# EAGLE design STl-Link-V200 (EAGLE 7.3.0)
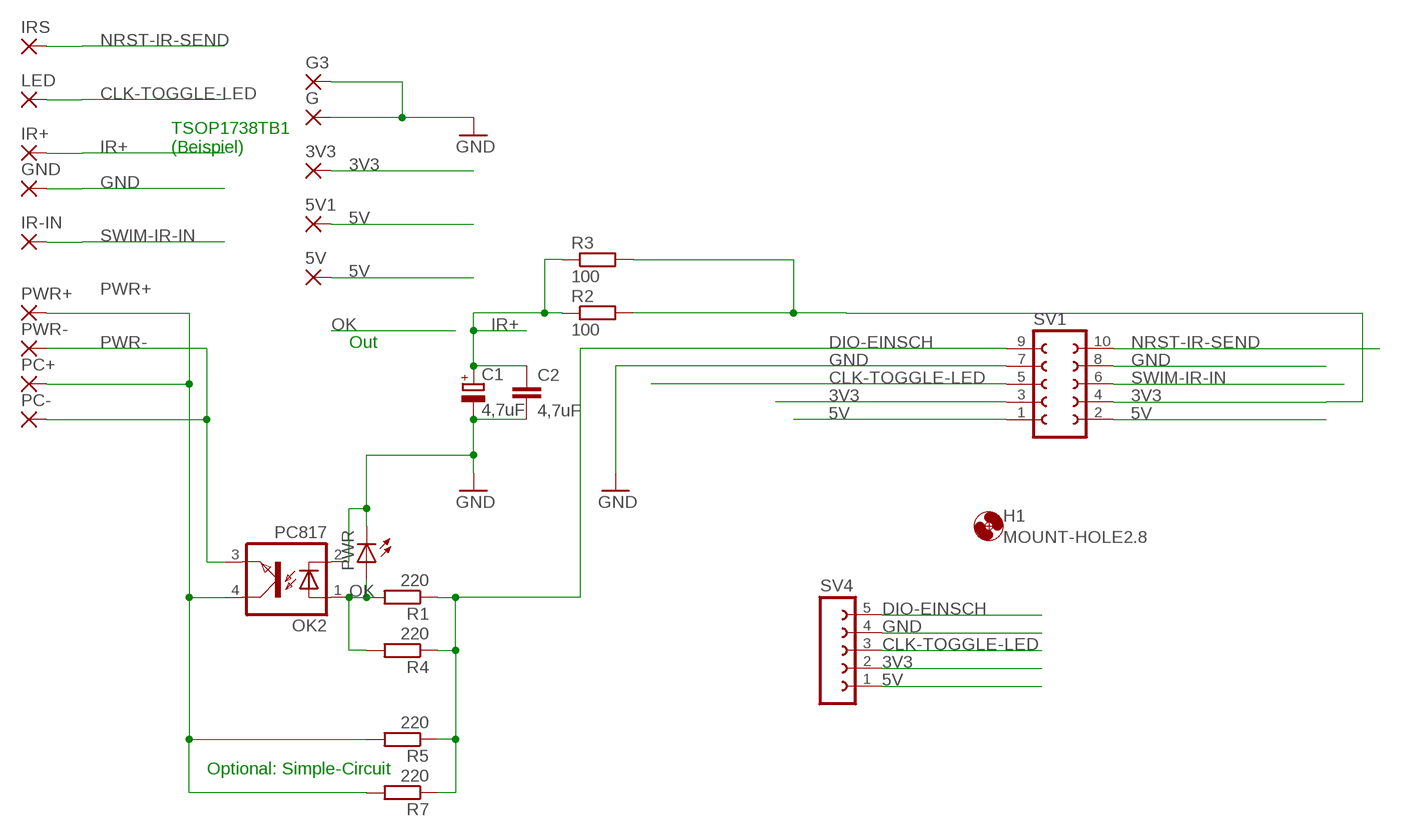
[diagram p0: schematic, sheet 1]

## Parts
3V3  SMD2  [SMD1,27-2,54]
5V  SMD2  [SMD1,27-2,54]
5V1  SMD2  [SMD1,27-2,54]
C1  4,7uF  CPOL-EUE1.8-4  [E1,8-4]
C2  4,7uF  C-EUC1206K  [C1206K]
G  SMD2  [SMD1,27-2,54]
G3  SMD2  [SMD1,27-2,54]
GND  SMD2  [SMD1,27-2,54]
H1  MOUNT-HOLE2.8  [2,8]
IR+  SMD2  [SMD1,27-2,54]
IR-IN  SMD2  [SMD1,27-2,54]
IRS  SMD2  [SMD1,27-2,54]
LED  SMD2  [SMD1,27-2,54]
OK2  PC817  [DIL04]
PC+  SMD2  [SMD1,27-2,54]
PC-  SMD2  [SMD1,27-2,54]
PWR  LEDCHIPLED_1206  [CHIPLED_1206]
PWR+  SMD2  [SMD1,27-2,54]
PWR-  SMD2  [SMD1,27-2,54]
R1  220  R-EU_0204/7  [0204/7]
R2  100  R-EU_0204/7  [0204/7]
R3  100  R-EU_R0805W  [R0805W]
R4  220  R-EU_R0805W  [R0805W]
R5  220  R-EU_0204/7  [0204/7]
R7  220  R-EU_R0805W  [R0805W]
SV1  FE05-2  [FE05-2]
SV4  FE05-1  [FE05-1]

## Nets
3V3: 3V3.1(P) R2.2 R3.2 SV1.3 SV1.4 SV4.2
5V: 5V1.1(P) 5V.1(P) SV1.1 SV1.2 SV4.1
CLK-TOGGLE-LED: LED.1(P) SV1.5 SV4.3
DIO-EINSCH: R1.1 R4.1 R5.1 R7.1 SV1.9 SV4.5
GND: C1.- C2.2 G3.1(P) G.1(P) GND.1(P) OK2.2(C) PWR.C SV1.7 SV1.8 SV4.4
IR+: C1.+ C2.1 IR+.1(P) R2.1 R3.1
NRST-IR-SEND: IRS.1(P) SV1.10
OK: OK2.1(A) PWR.A R1.2 R4.2
PWR+: OK2.4(COL) PC+.1(P) PWR+.1(P) R5.2 R7.2
PWR-: OK2.3(EMIT) PC-.1(P) PWR-.1(P)
SWIM-IR-IN: IR-IN.1(P) SV1.6

## Notes on the sheet
- TSOP1738TB1
  (Beispiel)
- Out
- Optional: Simple-Circuit

## Library data of the parts
3V3 5V 5V1 G G3 GND IR+ IR-IN IRS LED PC+ PC- PWR+ PWR- = wirepad:SMD2: SMD PAD
C1 = rcl:CPOL-EU: POLARIZED CAPACITOR, European symbol
C2 = rcl:C-EU: CAPACITOR, European symbol
H1 = holes:MOUNT-HOLE: MOUNTING HOLE with drill center marker
OK2 = optocoupler:PC817: SHARP OPTO COUPLER; MPN: PC817X4J000F; OC_FARNELL: 9707727; OC_NEWARK: 97K7059
PWR = led:LED: LED OSRAM: - CHIPLED LG R971, LG N971, LY N971, LG Q971, LY Q971, LO R971, LY R971 LH N974, LH R974 LS Q976, LO Q976, LY Q976 LO Q996 - Hyper CHIPLED LW Q18S LB Q993, LB Q99A, LB R99A - SideLED LS A670, LO A670, LY A670, LG A670, LP A670 LB A673, LV A673, LT A673, LW A673 LH A674 LY A675 LS A676, LA A676, LO A676, LY A676, LW A676 LS A679, LY A679, LG A679 - Hyper Micro SIDELED® LS Y876, LA Y876, LO Y876, LY Y876 LT Y87S - SmartLED LW L88C, LW L88S LB L89C, LB L89S, LG L890 LS L89K, LO L89K, LY L89K LS L896, LA L896, LO L896, LY L896 - TOPLED LS T670, LO T670, LY T670, LG T670, LP T670 LSG T670, LSP T670, LSY T670, LOP T670, LYG T670 LG T671, LOG T671, LSG T671 LB T673, LV T673, LT T673, LW T673 LH T674 LS T676, LA T676, LO T676, LY T676, LB T676, LH T676, LSB T676, LW T676 LB T67C, LV T67C, LT T67C, LS T67K, LO T67K, LY T67K, LW E67C LS E67B, LA E67B, LO E67B, LY E67B, LB E67C, LV E67C, LT E67C LW T67C LS T679, LY T679, LG T679 LS T770, LO T770, LY T770, LG T770, LP T770 LB T773, LV T773, LT T773, LW T773 LH T774 LS E675, LA E675, LY E675, LS T675 LS T776, LA T776, LO T776, LY T776, LB T776 LHGB T686 LT T68C, LB T68C - Hyper Mini TOPLED® LB M676 - Mini TOPLED Santana® LG M470 LS M47K, LO M47K, LY M47K Source: http://www.osram.convergy.de LUXEON: - LUMILED® LXK2-PW12-R00, LXK2-PW12-S00, LXK2-PW14-U00, LXK2-PW14-V00 LXK2-PM12-R00, LXK2-PM12-S00, LXK2-PM14-U00 LXK2-PE12-Q00, LXK2-PE12-R00, LXK2-PE12-S00, LXK2-PE14-T00, LXK2-PE14-U00 LXK2-PB12-K00, LXK2-PB12-L00, LXK2-PB12-M00, LXK2-PB14-N00, LXK2-PB14-P00, LXK2-PB14-Q00 LXK2-PR12-L00, LXK2-PR12-M00, LXK2-PR14-Q00, LXK2-PR14-R00 LXK2-PD12-Q00, LXK2-PD12-R00, LXK2-PD12-S00 LXK2-PH12-R00, LXK2-PH12-S00 LXK2-PL12-P00, LXK2-PL12-Q00, LXK2-PL12-R00 Source: www.luxeon.com KINGBRIGHT: KA-3528ASYC Source: www.kingbright.com
R1-R5 R7 = rcl:R-EU_: RESISTOR, European symbol
SV1 = con-lsta:FE05-2: FEMALE HEADER; OC_FARNELL: unknown; OC_NEWARK: unknown
SV4 = con-lsta:FE05-1: FEMALE HEADER; OC_FARNELL: unknown; OC_NEWARK: unknown

## Net classes
0 default: width 0.406 mm

## Board
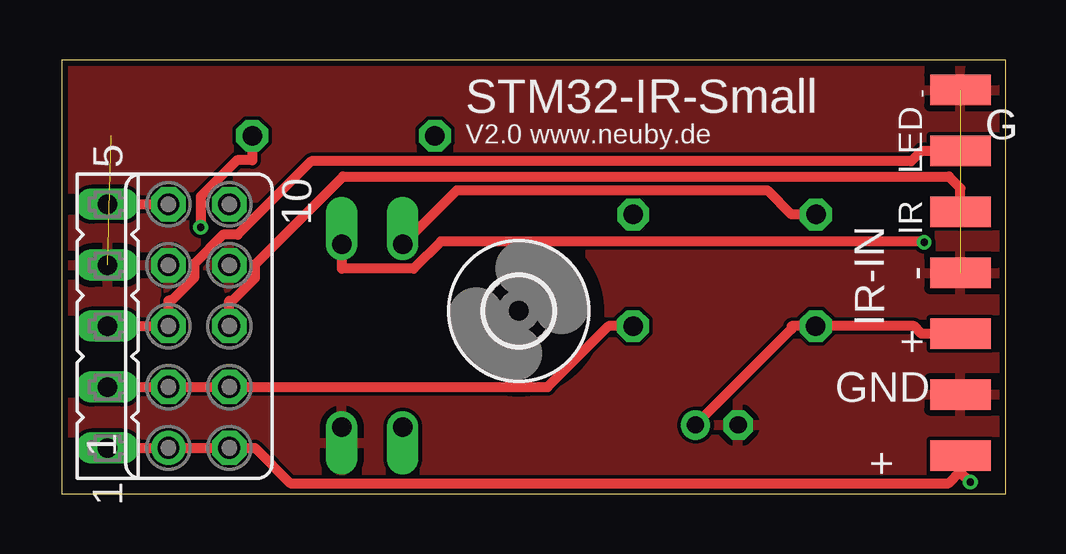
[diagram p1: board, top side]
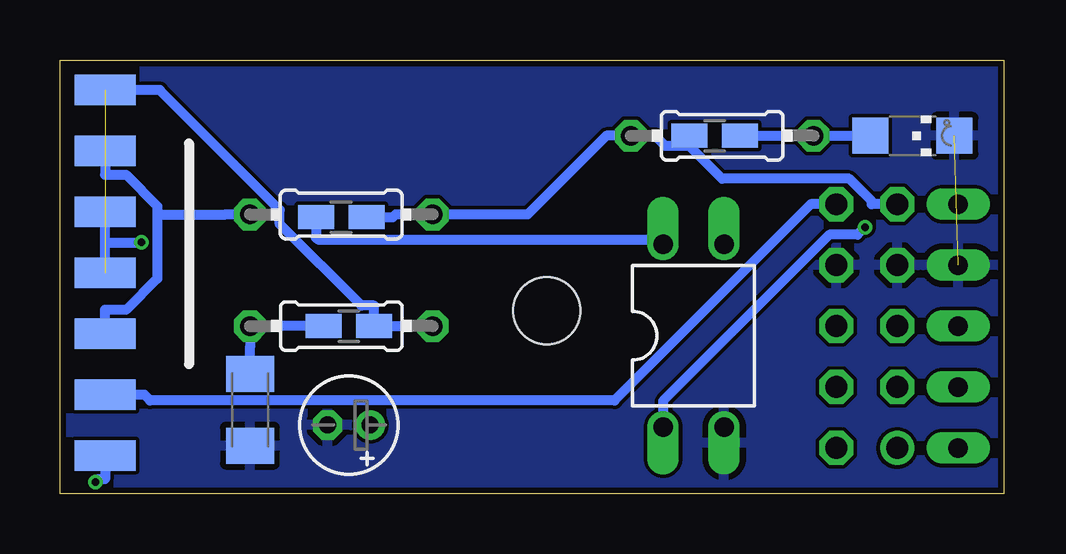
[diagram p2: board, bottom side, seen from below]

Size 39.35 x 18.09 mm. Coordinates in mm from the lower left corner, seen from the top.
Outline: 0,0 39.35,0 39.35,18.09 0,18.09 0,0
Copper layers (1*16): Top 0.035mm / dielectric 1.5mm / Bottom 0.035mm
Design rules "Fusion_eagle_rule_v1.1": minimum track width 6mil, minimum drill 12mil, track to track 6mil, track to pad 6mil, pad to pad 6mil, via to via 6mil, smd to smd 0mil, copper to edge 10mil, drill to drill 10mil, minimum pad ring 10mil, minimum via ring 6mil, stop-mask expansion 2mil, vias tented up to drill 100mil, thermal gap 10mil

### Footprints (pad centres in the part's own frame; a part is rotated, then mirrored left to right if it is on the bottom)
SMD1,27-2,54 = smd 1.27 x 2.54: 1 0,0
E1,8-4 = drill 0.711 pad 1.168: + -0.889,0 | drill 0.711 pad 1.168 octagon: - 0.889,0
C1206K = smd 1.5 x 2: 1 -1.5,0; 2 1.5,0
2,8 = hole 2.8: 0,0
DIL04 = drill 0.813 offset: 1 -1.27,-3.81; 2 1.27,-3.81; 3 1.27,3.81; 4 -1.27,3.81
CHIPLED_1206 = smd 1.5 x 1.5: A 0,-1.75; C 0,1.75
0204/7 = drill 0.813 octagon: 1 -3.81,0; 2 3.81,0
R0805W = smd 1.5 x 1: 1 -1.052,0; 2 1.052,0
FE05-2 = drill 0.914: 1 -5.08,1.27 | drill 0.914 octagon: 2 -5.08,-1.27; 3 -2.54,1.27; 4 -2.54,-1.27; 5 0,1.27; 6 0,-1.27; 7 2.54,1.27; 8 2.54,-1.27; 9 5.08,1.27; 10 5.08,-1.27
FE05-1 = drill 0.813 long: 1 -5.08,0; 2 -2.54,0; 3 0,0; 4 2.54,0; 5 5.08,0

### Placement (x,y rotation side)
3V3  37.47,16.83 90 bottom
5V  37.47,1.59 270 top
5V1  37.47,1.59 90 bottom
C1  27.3,2.86 180 bottom
C2  31.43,3.49 270 bottom
G  37.47,16.83 90 top
G3  37.47,4.13 90 top
GND  37.47,9.21 90 top
H1  19.05,7.62 0 top
IR+  37.47,6.67 90 top
IR-IN  37.47,11.75 90 top
IRS  37.47,4.13 270 bottom
LED  37.47,14.29 270 top
OK2  12.94,6.58 0 bottom
PC+  37.47,14.29 90 bottom
PC-  37.47,11.75 90 bottom
PWR  3.81,14.92 270 bottom
PWR+  37.47,6.67 90 bottom
PWR-  37.47,9.21 90 bottom
R1  11.75,14.92 0 bottom
R2  27.62,6.99 0 bottom
R3  27.3,6.99 0 bottom
R4  12.06,14.92 0 bottom
R5  27.63,11.64 180 bottom
R7  27.63,11.53 180 bottom
SV1  5.71,6.99 90 top
SV4  1.91,6.99 90 top

### Tracks (layer width: path | path; a pad name or v marks a point on that pad's centre or on a via)
3V3
  Top 0.406: R2.2 22.8,6.99 20.26,4.45 SV1.4 SV1.3 SV4.2
  Bottom 0.406: 3V3.1 35.18,16.83 30.18,11.83 30.18,11.24 26.79,7.84 26.25,7.84 R3.2 R2.2
5V  (via drill 0.3 pad 0.61)
  Top 0.406: 37.47,0.93 37.47,0.89 v37.87,0.48 | 5V1.1 37.47,0.93 | 37.47,0.93 36.97,0.44 9.52,0.44 8.05,1.91 SV1.2 SV1.1 SV4.1
  Bottom 0.406: 5V1.1 37.47,0.6 37.76,0.6 v37.87,0.48
CLK-TOGGLE-LED
  Top 0.406: SV4.3 SV1.5 4.45,8.05 4.58,8.05 5.51,8.98 5.51,9.58 6.72,10.79 7.33,10.79 10.4,13.86 35.41,13.86 35.84,14.29 LED.1
DIO-EINSCH
  Top 0.406: SV4.5 SV1.9
  Bottom 0.406: R7.1 25.47,11.53 25.36,11.64 R5.1 19.86,11.64 16.57,14.92 R1.1 14.54,14.92 14.11,14.49 13.12,14.49 | SV1.9 5.51,12.06 5.51,12.2 6.45,13.13 11.75,13.13 13.12,14.49 | R4.1 13.12,14.49
GND  (2 unrouted)
  pour Top: 0,18.1 0,0 39.37,0 39.37,17.78
  pour Bottom: 0,0 39.37,0 39.37,17.78 0,18.1
IR+
  Top 0.406: C1.+ 30.42,6.86 30.42,6.99 R2.1 35.52,6.99 35.84,6.67 IR+.1
  Bottom 0.406: R3.1 R2.1 31.43,6.1 C2.1
NRST-IR-SEND
  Bottom 0.406: IRS.1 35.84,4.13 35.6,3.89 16.23,3.89 8.05,12.06 SV1.10
OK  (via drill 0.3 pad 0.61)
  Top 0.406: R1.2 7.94,13.91 7.3,13.91 5.79,12.39 v5.79,11.11
  Bottom 0.406: v5.79,11.11 6.1,10.79 7.28,10.79 14.21,3.86 OK2.1 | PWR.A R1.2 R4.2
PWR+
  Top 0.406: R5.2 30.42,11.64 29.41,12.65 16.47,12.65 OK2.4
  Bottom 0.406: R7.2 28.68,10.67 28.61,10.6 14.41,10.6 OK2.4 | 35.29,11.64 32.45,11.64 R5.2 | 35.29,11.64 35.29,11.99 36.6,13.3 37.47,13.3 PC+.1 | 35.29,11.64 35.29,8.96 36.6,7.66 37.47,7.66 PWR+.1
PWR-  (via drill 0.3 pad 0.61)
  Top 0.406: OK2.3 11.67,9.38 14.66,9.38 15.8,10.52 35.91,10.52 v35.95,10.48
  Bottom 0.406: 37.47,10.48 PC-.1 | PWR-.1 37.47,10.48 | 37.47,10.48 v35.95,10.48
SWIM-IR-IN
  Top 0.406: IR-IN.1 37.47,12.74 36.98,13.22 11.72,13.22 8.05,9.56 8.05,8.98 7.12,8.05 6.98,8.05 SV1.6

### Text on the board
tNames: - | STM32-IR-Small | V2.0 www.neuby.de | LED | IR | - | IR-IN | + | GND | +
bValues: STM-IRMP V2.0 | 3V3 | www.neuby.de | + | PC | - | - | 220R | PWR | SW | + | 10uF | IRSen | 5V